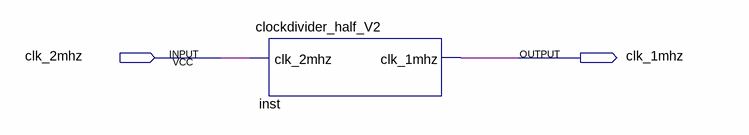
[diagram p0: schematic sheet]
// Quartus schematic testClockDivider.bdf as structural Verilog: 1 symbols, 2 pins
module testClockDivider (
  input  clk_2mhz,
  output clk_1mhz
);

  clockdivider_half_V2 inst (.clk_2mhz(clk_2mhz), .clk_1mhz(clk_1mhz));
endmodule
